# EAGLE schematic led_lamp (EAGLE 9.3.0)
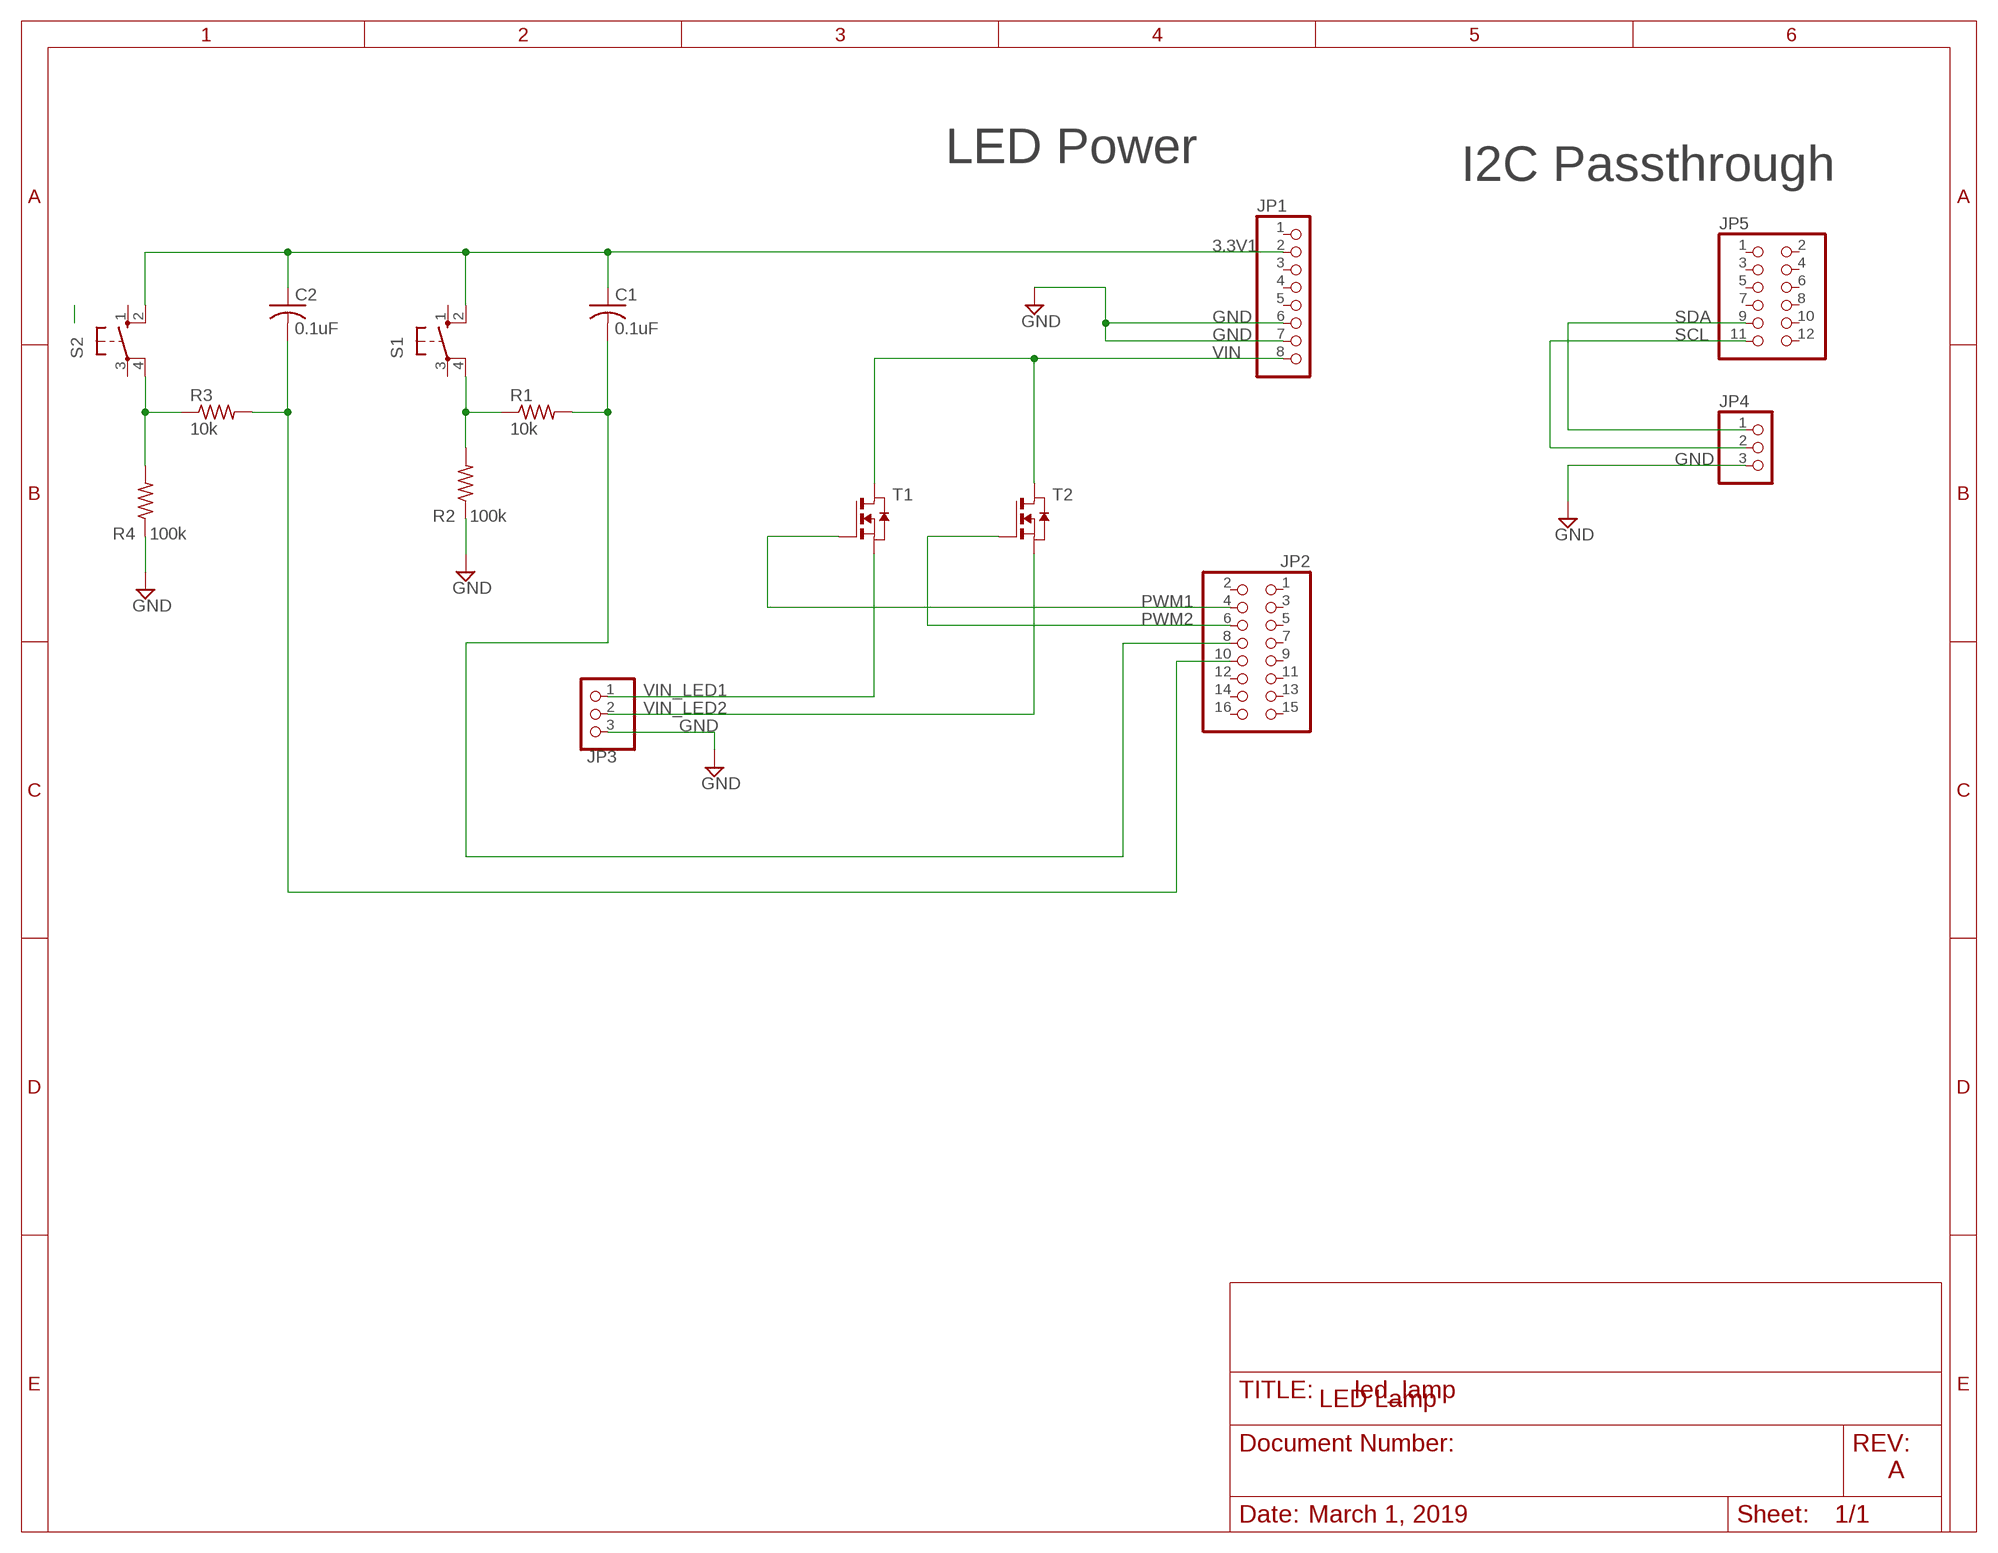
[diagram p0: schematic, sheet 1]

## Parts
C1  0.1uF  C-USC1206K  [C1206K]
C2  0.1uF  C-USC1206K  [C1206K]
JP1  PINHD-1X8  [1X08]
JP2  PINHD-2X8  [2X08]
JP3  PINHD-1X3  [1X03]
JP4  PINHD-1X3  [1X03]
JP5  PINHD-2X6  [2X06]
R1  10k  R-US_R1206  [R1206]
R2  100k  R-US_R1206  [R1206]
R3  10k  R-US_R1206  [R1206]
R4  100k  R-US_R1206  [R1206]
S1  10-XX  [B3F-10XX]
S2  10-XX  [B3F-10XX]
T1  NMOSSOT23  [SOT-23]
T2  NMOSSOT23  [SOT-23]

## Nets
3.3V1: C1.1 C2.1 JP1.2 S1.2(S1) S2.2(S1)
GND: JP1.6 JP1.7 JP3.3 JP4.3 R2.1 R4.1
N$1: R1.1 R2.2 S1.4(P1)
N$2: C1.2 JP2.8 R1.2
N$3: R3.1 R4.2 S2.4(P1)
N$4: C2.2 JP2.10 R3.2
PWM1: JP2.4 T1.3(G)
PWM2: JP2.6 T2.3(G)
SCL: JP4.2 JP5.11
SDA: JP4.1 JP5.9
VIN: JP1.8 T1.1(D) T2.1(D)
VIN_LED1: JP3.1 T1.2(S)
VIN_LED2: JP3.2 T2.2(S)
Unconnected: JP1.1 JP1.3 JP1.4 JP1.5 JP2.1 JP2.2 JP2.3 JP2.5 JP2.7 JP2.9 JP2.11 JP2.12 JP2.13 JP2.14 JP2.15 JP2.16 JP5.1 JP5.2 JP5.3 JP5.4 JP5.5 JP5.6 JP5.7 JP5.8 JP5.10 JP5.12 S1.1(S) S1.3(P) S2.1(S) S2.3(P)

## Notes on the sheet
- LED Power
- I2C Passthrough
- LED Lamp
- A
- March 1, 2019

## Library data of the parts
C1 C2 = rcl:C-US: CAPACITOR, American symbol; SPICEPREFIX: C
JP1 = pinhead:PINHD-1X8: PIN HEADER
JP2 = pinhead:PINHD-2X8: PIN HEADER
JP3 JP4 = pinhead:PINHD-1X3: PIN HEADER
JP5 = pinhead:PINHD-2X6: PIN HEADER
R1-R4 = rcl:R-US_: RESISTOR, American symbol; SPICEPREFIX: R
S1 S2 = switch-omron:10-XX: OMRON SWITCH; MPN: B3F-1000; OC_FARNELL: 176432; OC_NEWARK: 36M3542
T1 T2 = zetex:NMOSSOT23: MOS FET; OC_FARNELL: unknown; OC_NEWARK: unknown